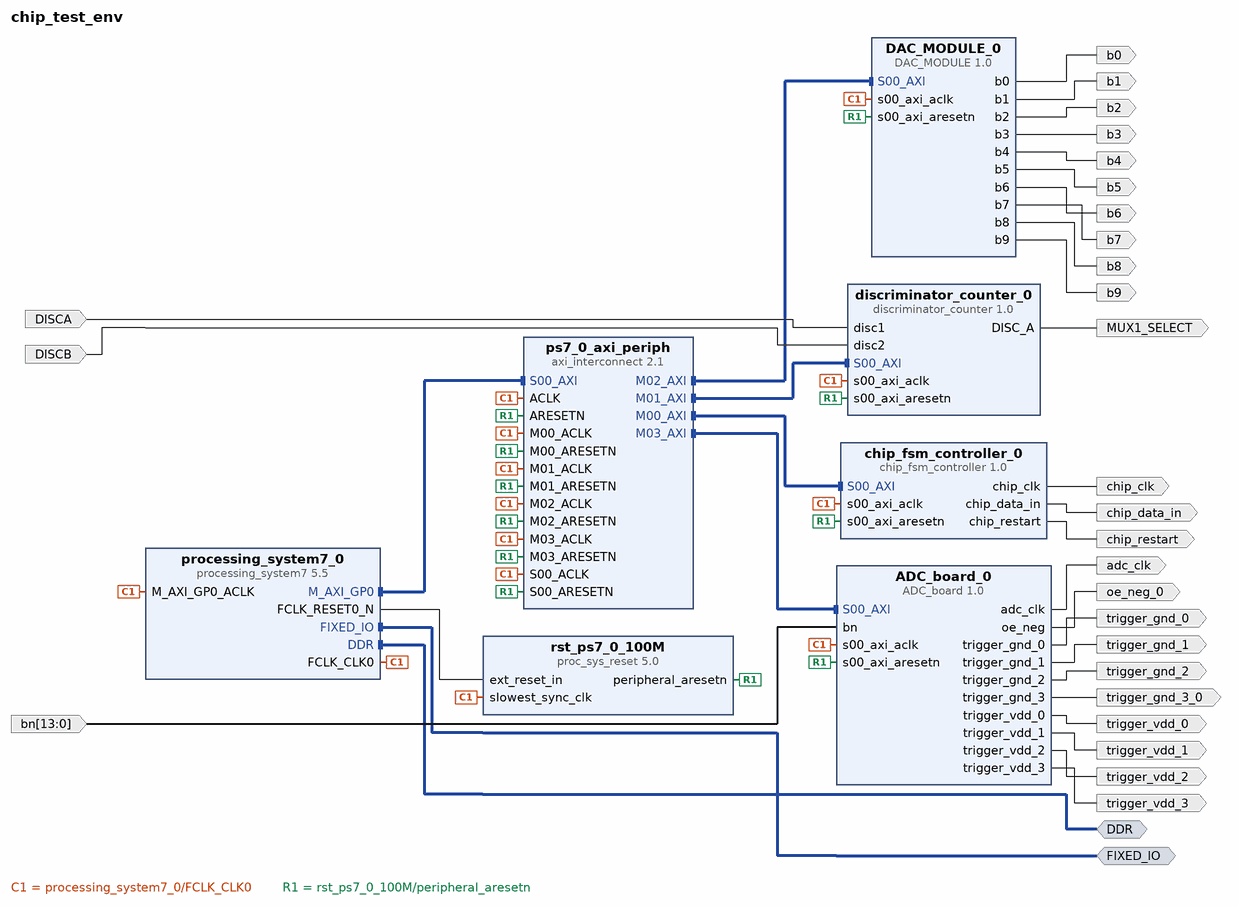
[diagram p0: block diagram of the top level]
# Vivado block design chip_test_env, xc7z010clg400-1, Vivado 2020.2
create_bd_design chip_test_env

create_bd_intf_port -mode Master -vlnv xilinx.com:interface:ddrx_rtl:1.0 DDR
create_bd_intf_port -mode Master -vlnv xilinx.com:display_processing_system7:fixedio_rtl:1.0 FIXED_IO
create_bd_port -dir I DISCA
create_bd_port -dir I DISCB
create_bd_port -dir O MUX1_SELECT
create_bd_port -dir O -type clk chip_clk
create_bd_port -dir O chip_data_in
create_bd_port -dir O chip_restart
create_bd_port -dir O b8
create_bd_port -dir O b7
create_bd_port -dir O b6
create_bd_port -dir O b3
create_bd_port -dir O b2
create_bd_port -dir O b5
create_bd_port -dir O b4
create_bd_port -dir O b1
create_bd_port -dir O b0
create_bd_port -dir O b9
create_bd_port -dir O trigger_gnd_3_0
create_bd_port -dir O trigger_vdd_3
create_bd_port -dir O trigger_gnd_1
create_bd_port -dir O -type clk adc_clk
create_bd_port -dir O trigger_vdd_1
create_bd_port -dir O trigger_gnd_2
create_bd_port -dir O trigger_gnd_0
create_bd_port -dir O trigger_vdd_2
create_bd_port -dir O trigger_vdd_0
create_bd_port -dir O oe_neg_0
create_bd_port -dir I -from 13 -to 0 bn

create_bd_cell -type ip -vlnv xilinx.com:ip:processing_system7:5.5 processing_system7_0
set_property -dict [list \
  CONFIG.PCW_APU_PERIPHERAL_FREQMHZ 650 \
  CONFIG.PCW_CRYSTAL_PERIPHERAL_FREQMHZ 50.000000 \
  CONFIG.PCW_ENET0_ENET0_IO {MIO 16 .. 27} \
  CONFIG.PCW_ENET0_GRP_MDIO_ENABLE 1 \
  CONFIG.PCW_ENET0_GRP_MDIO_IO {MIO 52 .. 53} \
  CONFIG.PCW_ENET0_PERIPHERAL_ENABLE 1 \
  CONFIG.PCW_ENET0_RESET_ENABLE 0 \
  CONFIG.PCW_ENET_RESET_ENABLE 1 \
  CONFIG.PCW_ENET_RESET_SELECT {Share reset pin} \
  CONFIG.PCW_FPGA0_PERIPHERAL_FREQMHZ 100 \
  CONFIG.PCW_FPGA1_PERIPHERAL_FREQMHZ 50 \
  CONFIG.PCW_GP0_EN_MODIFIABLE_TXN 0 \
  CONFIG.PCW_GP1_EN_MODIFIABLE_TXN 0 \
  CONFIG.PCW_GPIO_MIO_GPIO_ENABLE 1 \
  CONFIG.PCW_GPIO_MIO_GPIO_IO MIO \
  CONFIG.PCW_I2C_RESET_ENABLE 1 \
  CONFIG.PCW_PERIPHERAL_BOARD_PRESET part0 \
  CONFIG.PCW_PRESET_BANK1_VOLTAGE {LVCMOS 1.8V} \
  CONFIG.PCW_QSPI_GRP_FBCLK_ENABLE 1 \
  CONFIG.PCW_QSPI_GRP_FBCLK_IO {MIO 8} \
  CONFIG.PCW_QSPI_GRP_SINGLE_SS_ENABLE 1 \
  CONFIG.PCW_QSPI_GRP_SINGLE_SS_IO {MIO 1 .. 6} \
  CONFIG.PCW_QSPI_PERIPHERAL_ENABLE 1 \
  CONFIG.PCW_QSPI_QSPI_IO {MIO 1 .. 6} \
  CONFIG.PCW_SD0_GRP_CD_ENABLE 1 \
  CONFIG.PCW_SD0_GRP_CD_IO {MIO 47} \
  CONFIG.PCW_SD0_GRP_WP_ENABLE 1 \
  CONFIG.PCW_SD0_GRP_WP_IO EMIO \
  CONFIG.PCW_SD0_PERIPHERAL_ENABLE 1 \
  CONFIG.PCW_SD0_SD0_IO {MIO 40 .. 45} \
  CONFIG.PCW_SDIO_PERIPHERAL_FREQMHZ 50 \
  CONFIG.PCW_SINGLE_QSPI_DATA_MODE x4 \
  CONFIG.PCW_TTC0_PERIPHERAL_ENABLE 1 \
  CONFIG.PCW_TTC0_TTC0_IO EMIO \
  CONFIG.PCW_UART1_PERIPHERAL_ENABLE 1 \
  CONFIG.PCW_UART1_UART1_IO {MIO 48 .. 49} \
  CONFIG.PCW_UART_PERIPHERAL_FREQMHZ 100 \
  CONFIG.PCW_UIPARAM_DDR_FREQ_MHZ 525 \
  CONFIG.PCW_UIPARAM_DDR_PARTNO {MT41K128M16 JT-125} \
  CONFIG.PCW_USB0_PERIPHERAL_ENABLE 1 \
  CONFIG.PCW_USB0_RESET_ENABLE 1 \
  CONFIG.PCW_USB0_RESET_IO {MIO 46} \
  CONFIG.PCW_USB0_USB0_IO {MIO 28 .. 39} \
  CONFIG.PCW_USB_RESET_ENABLE 1 \
  CONFIG.PCW_USB_RESET_SELECT {Share reset pin} \
] [get_bd_cells processing_system7_0]
# 499 more settings of processing_system7_0 are not shown: defaults, MIO pin electricals, DDR timing, and values the tool derives
create_bd_cell -type ip -vlnv xilinx.com:ip:axi_interconnect:2.1 ps7_0_axi_periph
set_property -dict {CONFIG.NUM_MI 4} [get_bd_cells ps7_0_axi_periph]
create_bd_cell -type ip -vlnv xilinx.com:ip:proc_sys_reset:5.0 rst_ps7_0_100M
create_bd_cell -type ip -vlnv user.org:user:discriminator_counter:1.0 discriminator_counter_0
create_bd_cell -type ip -vlnv user.org:user:DAC_MODULE:1.0 DAC_MODULE_0
create_bd_cell -type ip -vlnv user.org:user:chip_fsm_controller:1.0 chip_fsm_controller_0
create_bd_cell -type ip -vlnv user.org:user:ADC_board:1.0 ADC_board_0

# ---- connections ----

connect_bd_intf_net [get_bd_intf_pins ps7_0_axi_periph/M00_AXI] [get_bd_intf_pins chip_fsm_controller_0/S00_AXI]
connect_bd_intf_net [get_bd_intf_pins ps7_0_axi_periph/M02_AXI] [get_bd_intf_pins DAC_MODULE_0/S00_AXI]
connect_bd_intf_net [get_bd_intf_pins ps7_0_axi_periph/M03_AXI] [get_bd_intf_pins ADC_board_0/S00_AXI]
connect_bd_intf_net [get_bd_intf_pins ps7_0_axi_periph/M01_AXI] [get_bd_intf_pins discriminator_counter_0/S00_AXI]
connect_bd_intf_net [get_bd_intf_ports FIXED_IO] [get_bd_intf_pins processing_system7_0/FIXED_IO]
connect_bd_intf_net [get_bd_intf_pins processing_system7_0/M_AXI_GP0] [get_bd_intf_pins ps7_0_axi_periph/S00_AXI]
connect_bd_intf_net [get_bd_intf_ports DDR] [get_bd_intf_pins processing_system7_0/DDR]
connect_bd_net [get_bd_pins processing_system7_0/FCLK_CLK0] \
  [get_bd_pins processing_system7_0/M_AXI_GP0_ACLK] [get_bd_pins ps7_0_axi_periph/S00_ACLK] \
  [get_bd_pins rst_ps7_0_100M/slowest_sync_clk] [get_bd_pins ps7_0_axi_periph/M00_ACLK] [get_bd_pins ps7_0_axi_periph/ACLK] \
  [get_bd_pins ps7_0_axi_periph/M01_ACLK] [get_bd_pins discriminator_counter_0/s00_axi_aclk] \
  [get_bd_pins DAC_MODULE_0/s00_axi_aclk] [get_bd_pins ps7_0_axi_periph/M02_ACLK] [get_bd_pins ps7_0_axi_periph/M03_ACLK] \
  [get_bd_pins chip_fsm_controller_0/s00_axi_aclk] [get_bd_pins ADC_board_0/s00_axi_aclk]
connect_bd_net [get_bd_pins processing_system7_0/FCLK_RESET0_N] [get_bd_pins rst_ps7_0_100M/ext_reset_in]
connect_bd_net [get_bd_pins rst_ps7_0_100M/peripheral_aresetn] \
  [get_bd_pins ps7_0_axi_periph/S00_ARESETN] [get_bd_pins ps7_0_axi_periph/M00_ARESETN] \
  [get_bd_pins ps7_0_axi_periph/ARESETN] [get_bd_pins ps7_0_axi_periph/M01_ARESETN] \
  [get_bd_pins discriminator_counter_0/s00_axi_aresetn] [get_bd_pins DAC_MODULE_0/s00_axi_aresetn] \
  [get_bd_pins ps7_0_axi_periph/M02_ARESETN] [get_bd_pins ps7_0_axi_periph/M03_ARESETN] \
  [get_bd_pins chip_fsm_controller_0/s00_axi_aresetn] [get_bd_pins ADC_board_0/s00_axi_aresetn]
connect_bd_net -net disc1_0_1 [get_bd_ports DISCA] [get_bd_pins discriminator_counter_0/disc1]
connect_bd_net -net disc2_0_1 [get_bd_ports DISCB] [get_bd_pins discriminator_counter_0/disc2]
connect_bd_net [get_bd_pins discriminator_counter_0/DISC_A] [get_bd_ports MUX1_SELECT]
connect_bd_net [get_bd_pins chip_fsm_controller_0/chip_clk] [get_bd_ports chip_clk]
connect_bd_net [get_bd_pins chip_fsm_controller_0/chip_data_in] [get_bd_ports chip_data_in]
connect_bd_net [get_bd_pins chip_fsm_controller_0/chip_restart] [get_bd_ports chip_restart]
connect_bd_net [get_bd_pins DAC_MODULE_0/b8] [get_bd_ports b8]
connect_bd_net [get_bd_pins DAC_MODULE_0/b7] [get_bd_ports b7]
connect_bd_net [get_bd_pins DAC_MODULE_0/b6] [get_bd_ports b6]
connect_bd_net [get_bd_pins DAC_MODULE_0/b3] [get_bd_ports b3]
connect_bd_net [get_bd_pins DAC_MODULE_0/b2] [get_bd_ports b2]
connect_bd_net [get_bd_pins DAC_MODULE_0/b5] [get_bd_ports b5]
connect_bd_net [get_bd_pins DAC_MODULE_0/b4] [get_bd_ports b4]
connect_bd_net [get_bd_pins DAC_MODULE_0/b1] [get_bd_ports b1]
connect_bd_net [get_bd_pins DAC_MODULE_0/b0] [get_bd_ports b0]
connect_bd_net [get_bd_pins DAC_MODULE_0/b9] [get_bd_ports b9]
connect_bd_net [get_bd_pins ADC_board_0/trigger_gnd_3] [get_bd_ports trigger_gnd_3_0]
connect_bd_net [get_bd_pins ADC_board_0/trigger_vdd_3] [get_bd_ports trigger_vdd_3]
connect_bd_net [get_bd_pins ADC_board_0/trigger_gnd_1] [get_bd_ports trigger_gnd_1]
connect_bd_net [get_bd_pins ADC_board_0/adc_clk] [get_bd_ports adc_clk]
connect_bd_net [get_bd_pins ADC_board_0/trigger_vdd_1] [get_bd_ports trigger_vdd_1]
connect_bd_net [get_bd_pins ADC_board_0/trigger_gnd_2] [get_bd_ports trigger_gnd_2]
connect_bd_net [get_bd_pins ADC_board_0/trigger_gnd_0] [get_bd_ports trigger_gnd_0]
connect_bd_net [get_bd_pins ADC_board_0/trigger_vdd_2] [get_bd_ports trigger_vdd_2]
connect_bd_net [get_bd_pins ADC_board_0/trigger_vdd_0] [get_bd_ports trigger_vdd_0]
connect_bd_net [get_bd_pins ADC_board_0/oe_neg] [get_bd_ports oe_neg_0]
connect_bd_net -net bn_0_1 [get_bd_ports bn] [get_bd_pins ADC_board_0/bn]

# ---- address map ----
assign_bd_address -offset 0x43C00000 -range 64K -target_address_space [get_bd_addr_spaces processing_system7_0/Data] [get_bd_addr_segs chip_fsm_controller_0/S00_AXI/S00_AXI_reg]
assign_bd_address -offset 0x43C10000 -range 64K -target_address_space [get_bd_addr_spaces processing_system7_0/Data] [get_bd_addr_segs discriminator_counter_0/S00_AXI/S00_AXI_reg]
assign_bd_address -offset 0x43C20000 -range 64K -target_address_space [get_bd_addr_spaces processing_system7_0/Data] [get_bd_addr_segs DAC_MODULE_0/S00_AXI/S00_AXI_reg]
assign_bd_address -offset 0x43C30000 -range 64K -target_address_space [get_bd_addr_spaces processing_system7_0/Data] [get_bd_addr_segs ADC_board_0/S00_AXI/S00_AXI_reg]

validate_bd_design
save_bd_design
